# Altium schematic sheet Left_Ref_Sensor_SchDoc.SchDoc
size A4
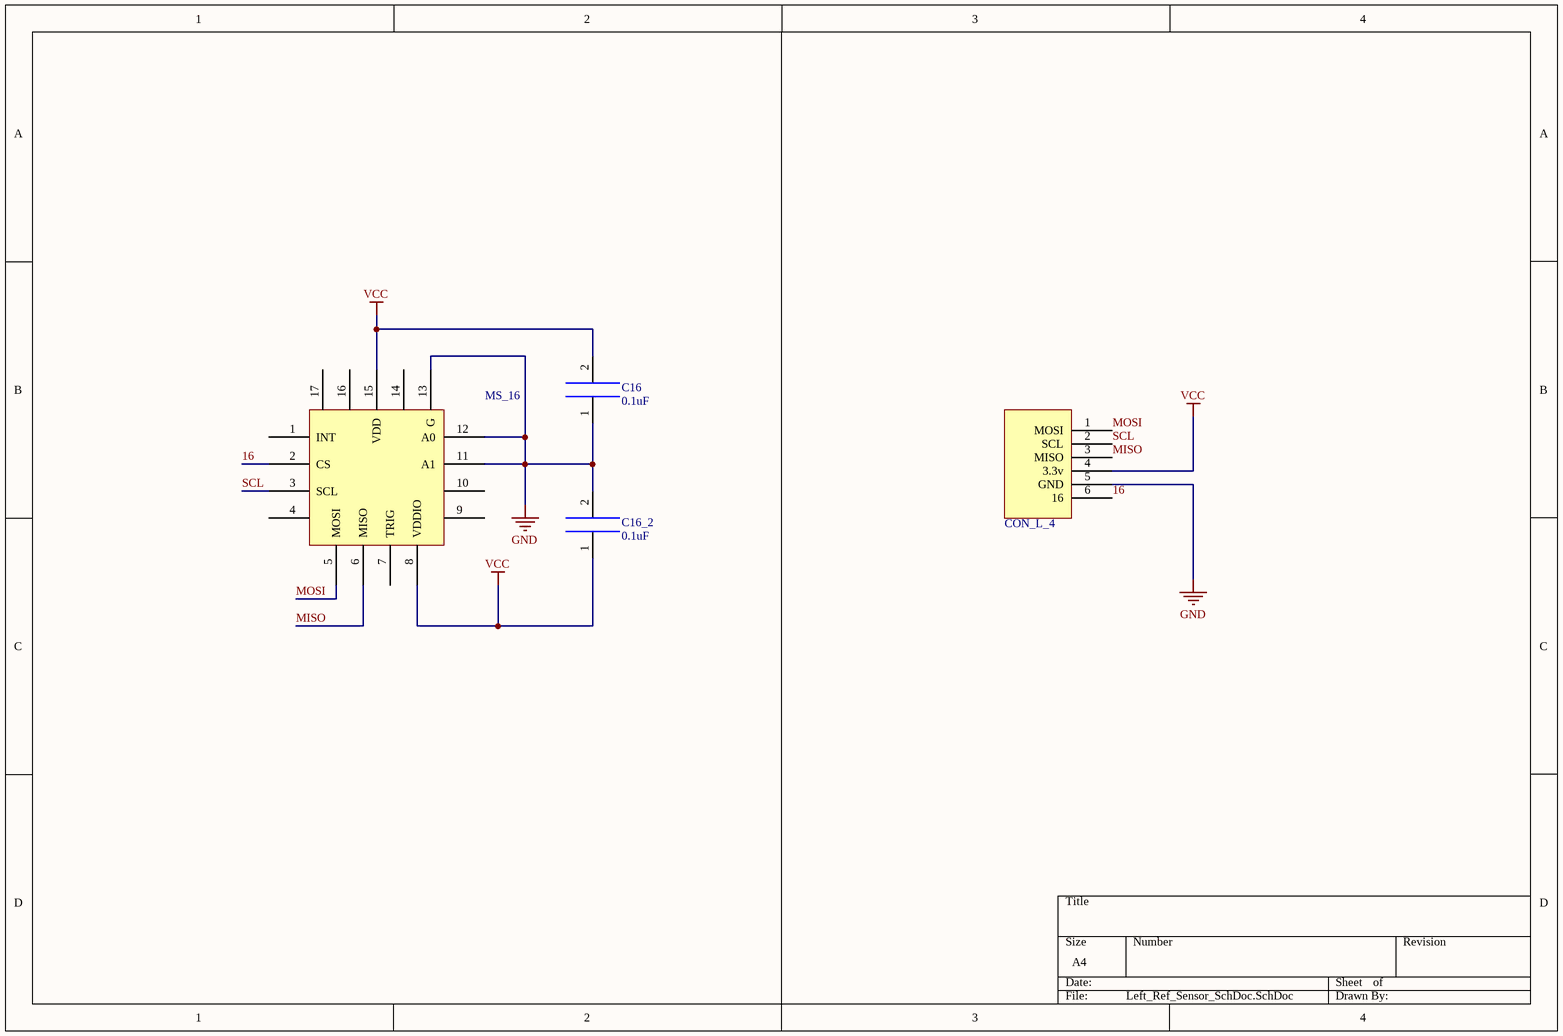
[diagram p0: Left_Ref_Sensor_SchDoc.SchDoc]

## Parts
C16  0.1uF  [CAP_0603]
C16_2  0.1uF  [CAP_0603]
CON_L_4  PIN_left  [PIN_Left_4]  (value not drawn)
MS_16  MLX90393SLW ABA 011 RE  [MLX90393]  (value not drawn)

## Nets
GND: C16.1 C16_2.2 CON_L_4.5(GND) MS_16.11(A1) MS_16.12(A0) MS_16.13(G)
VCC: C16.2 C16_2.1 CON_L_4.4(3.3v) MS_16.8(VDDIO) MS_16.15(VDD)
16: CON_L_4.6(16) MS_16.2(CS)
MISO: CON_L_4.3(MISO) MS_16.6(MISO)
MOSI: CON_L_4.1(MOSI) MS_16.5(MOSI)
SCL: CON_L_4.2(SCL) MS_16.3(SCL)

Not connected (* = marked no-connect by the designer): MS_16 1(INT) 4 7(TRIG) 9 10 14 16 17

## Library data of the parts
C16 C16_2 = CAP: Capacitance
CON_L_4 = PIN_left_4
MS_16 = MLX90393SLW ABA 011 RE: MLX90393 Sensor